# EAGLE design TopCorner (EAGLE 5.10)
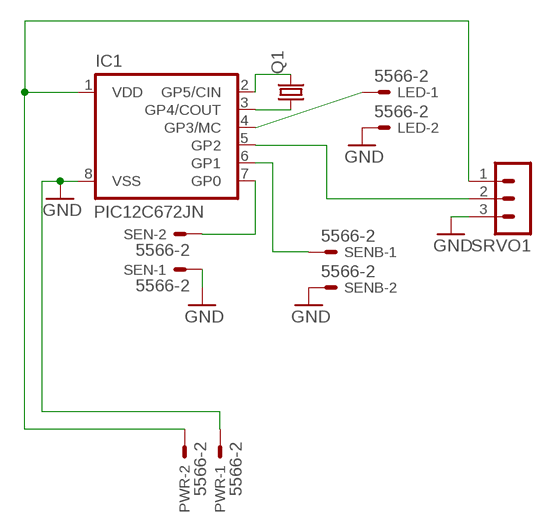
[diagram p0: schematic, sheet 1]

## Parts
IC1  PIC12C672JN  [DIL8]
LED  5566-2  [5566-2]
PWR  5566-2  [5566-2]
Q1  CRYSTALHC18U-V  [HC18U-V]
SEN  5566-2  [5566-2]
SENB  5566-2  [5566-2]
SRVO1  MA03-1  [MA03-1]

## Nets
GND: IC1.8(VSS) LED.2 PWR.1 SEN.1 SENB.2 SRVO1.3
N$1: IC1.1(VDD) PWR.2 SRVO1.1
N$2: IC1.6(GP1) SENB.1
N$3: IC1.3(GP4/COUT) Q1.1
N$4: IC1.2(GP5/CIN) Q1.2
N$5: IC1.7(GP0) SEN.2
N$6: IC1.5(GP2) SRVO1.2
N$7: IC1.4(GP3/MC) LED.1

## Library data of the parts
IC1 = microchip:PIC12C*?: MICROCONTROLLER
LED PWR SEN SENB = con-molex:5566-2: Mini FIT connector 2 pol Source: http://www.molex.com
Q1 = crystal:CRYSTAL: CRYSTAL
SRVO1 = con-lstb:MA03-1: PIN HEADER

## Board
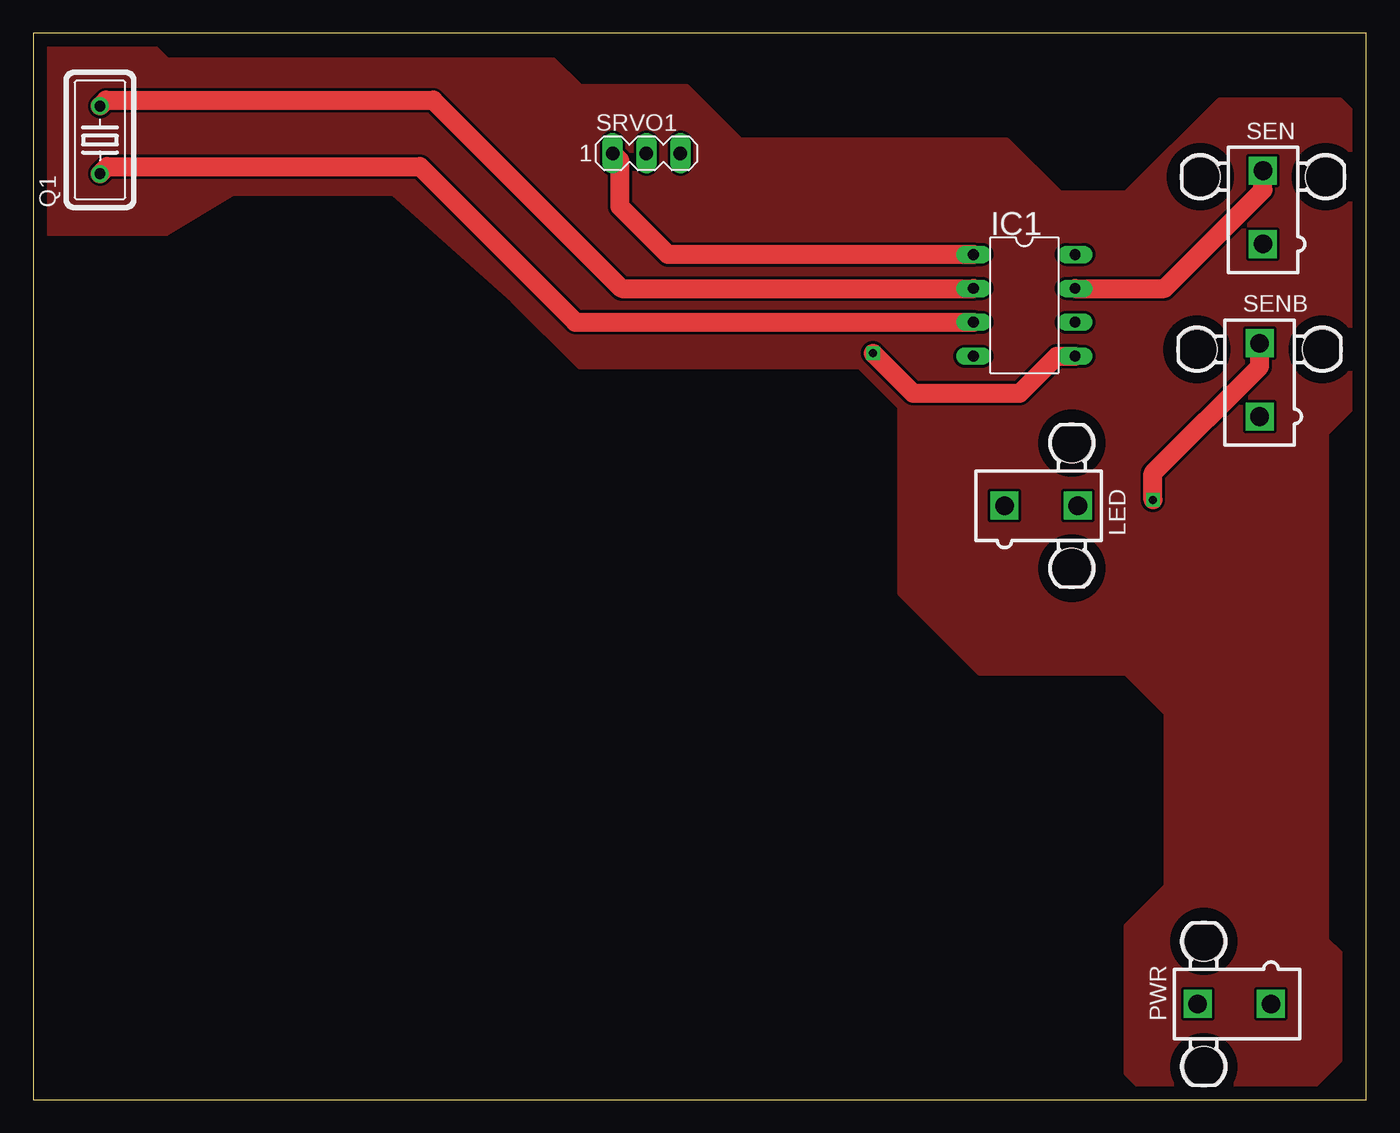
[diagram p1: board, top side]
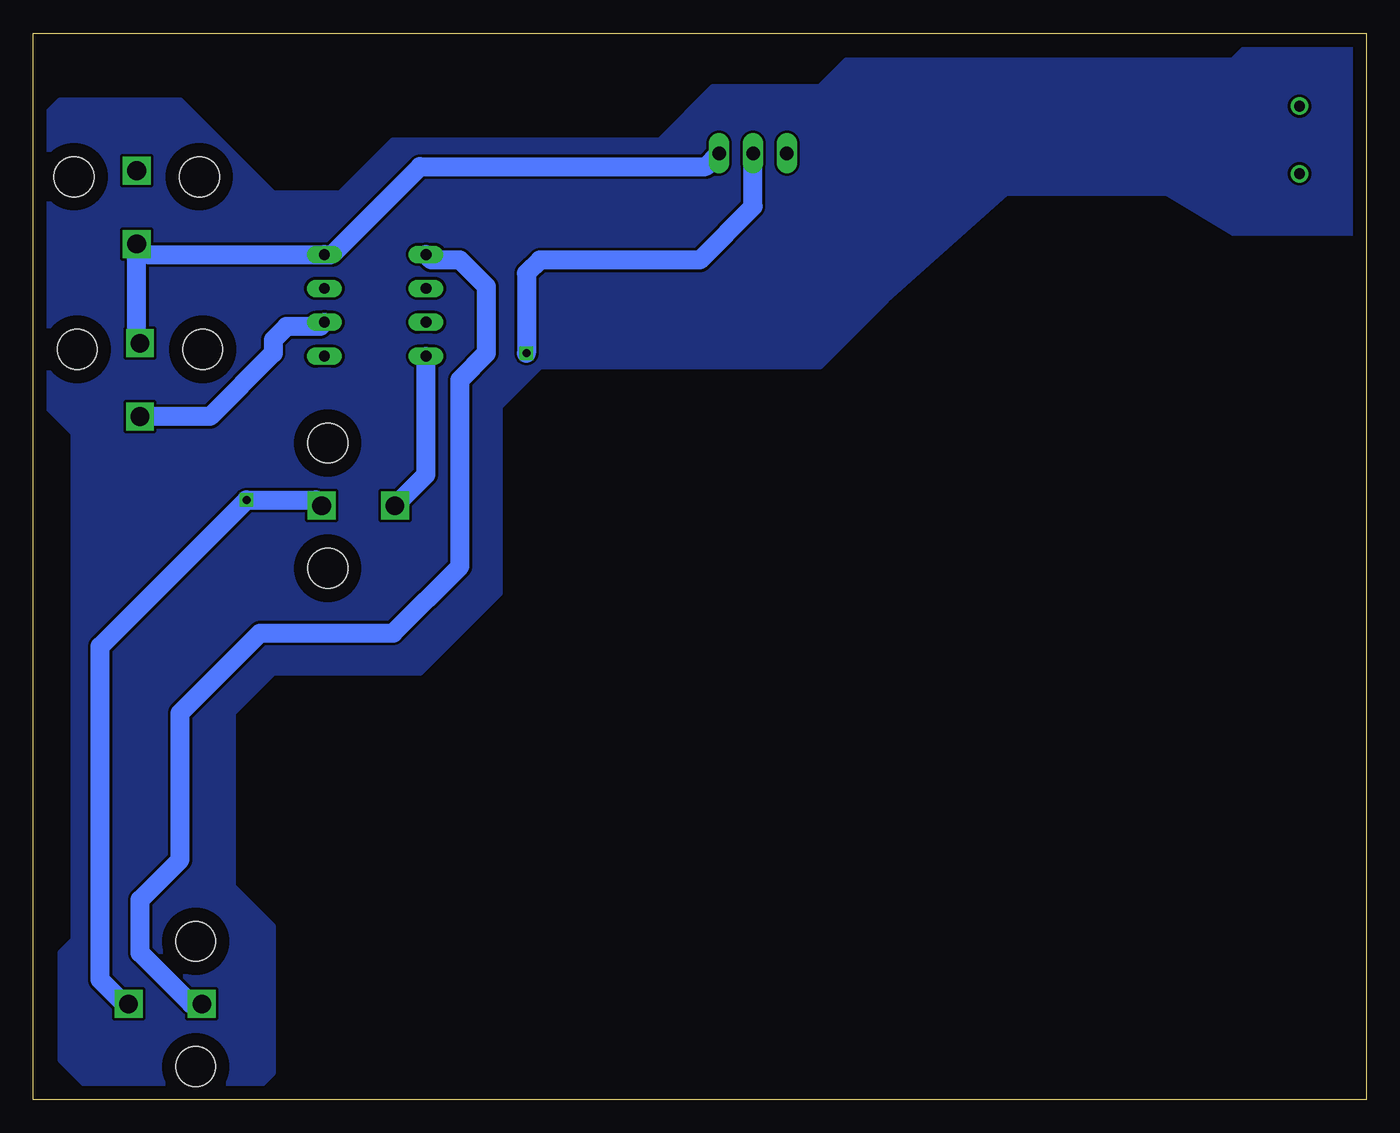
[diagram p2: board, bottom side, seen from below]

Size 100 x 80 mm. Coordinates in mm from the lower left corner, seen from the top.
Outline: 0,0 82,0 100,0 100,80 0,80 0,0
Copper layers (1*16): Top 0.035mm / dielectric 1.5mm / Bottom 0.035mm
Design rules "default": minimum track width 10mil, minimum drill 24mil, track to track 8mil, track to pad 8mil, pad to pad 8mil, via to via 8mil, smd to smd 8mil, copper to edge 40mil, drill to drill 8mil, minimum pad ring 10mil, minimum via ring 8mil, stop-mask expansion 4mil, vias tented up to drill 0mil, thermal gap 10mil

### Footprints (pad centres in the part's own frame; a part is rotated, then mirrored left to right if it is on the bottom)
DIL8 = drill 0.813 long: 1 -3.81,-3.81; 2 -1.27,-3.81; 3 1.27,-3.81; 4 3.81,-3.81; 5 3.81,3.81; 6 1.27,3.81; 7 -1.27,3.81; 8 -3.81,3.81
5566-2 = drill 1.4 square: 1 0,-2.75; 2 0,2.75 | hole 3: 4.7,2.29; -4.7,2.29
HC18U-V = drill 0.813 round: 1 -2.54,0; 2 2.54,0
MA03-1 = drill 1.016 long: 1 -2.54,0; 2 0,0; 3 2.54,0

### Placement (x,y rotation side)
IC1  74.35,59.59 270 top
LED  75.62,44.56 270 top
PWR  90.11,7.17 90 top
Q1  5,72 90 top
SEN  92.25,66.94 0 top
SENB  92,54 0 top
SRVO1  46,71 0 top

### Tracks (layer width: path | path; a pad name or v marks a point on that pad's centre or on a via)
GND  (via drill 0.6)
  Top 1.422: SENB.2 92,55 84,47 v84,45
  Bottom 1.422: LED.2 78.81,45 v84,45 95,34 95,9 93.17,7.17 PWR.1 | SENB.2 92.25,57 SEN.1 91.46,63.4 IC1.8 77.6,63.4 71,70 49.54,70 SRVO1.3
N$1
  Top 1.422: IC1.1 47.6,63.4 44,67 44,70.46 SRVO1.1
  Bottom 1.422: PWR.2 88.17,7.17 92,11 92,15 89,18 89,29 83,35 73,35 68,40 68,54 66,56 66,61 68,63 70.14,63 IC1.1
N$2
  Bottom 1.422: SENB.1 86.75,51.25 82,56 82,57 81,58 78.48,58 IC1.6
N$3
  Top 1.422: IC1.3 40.68,58.32 29,70 5.54,70 Q1.1
N$4
  Top 1.422: IC1.2 44.14,60.86 30,75 5.46,75 Q1.2
N$5
  Top 1.422: SEN.2 92.25,68.25 84.86,60.86 IC1.7
N$6  (via drill 0.6)
  Top 1.422: IC1.5 76.78,55.78 74,53 66,53 v63,56
  Bottom 1.422: v63,56 63,62 62,63 50,63 46,67 SRVO1.2
N$7
  Bottom 1.422: LED.1 70.54,46.89 IC1.4
N$9
  pour Bottom: 0,80 8,80 10,78 39,78 41,76 49,76 53,72 73,72 77,68 82,68 89,75 98,75 100,73 100,53 97,50 97,12 98,11 98,3 95,0 84,0 82,2 82,13 85,16 85,29 82,32 71,32 65,38 65,52 62,55 41,55 36,60 27,68 15,68 10,65 0,65
N$10
  pour Top: 0,80 8,80 10,78 39,78 41,76 49,76 53,72 73,72 77,68 82,68 89,75 98,75 100,73 100,53 97,50 97,12 98,11 98,3 95,0 84,0 82,2 82,13 85,16 85,29 82,32 71,32 65,38 65,52 62,55 41,55 36,60 27,68 15,68 10,65 0,65